# Altium schematic sheet sch_Gateway_RS232-Wifi_ESP8266.SchDoc
size A
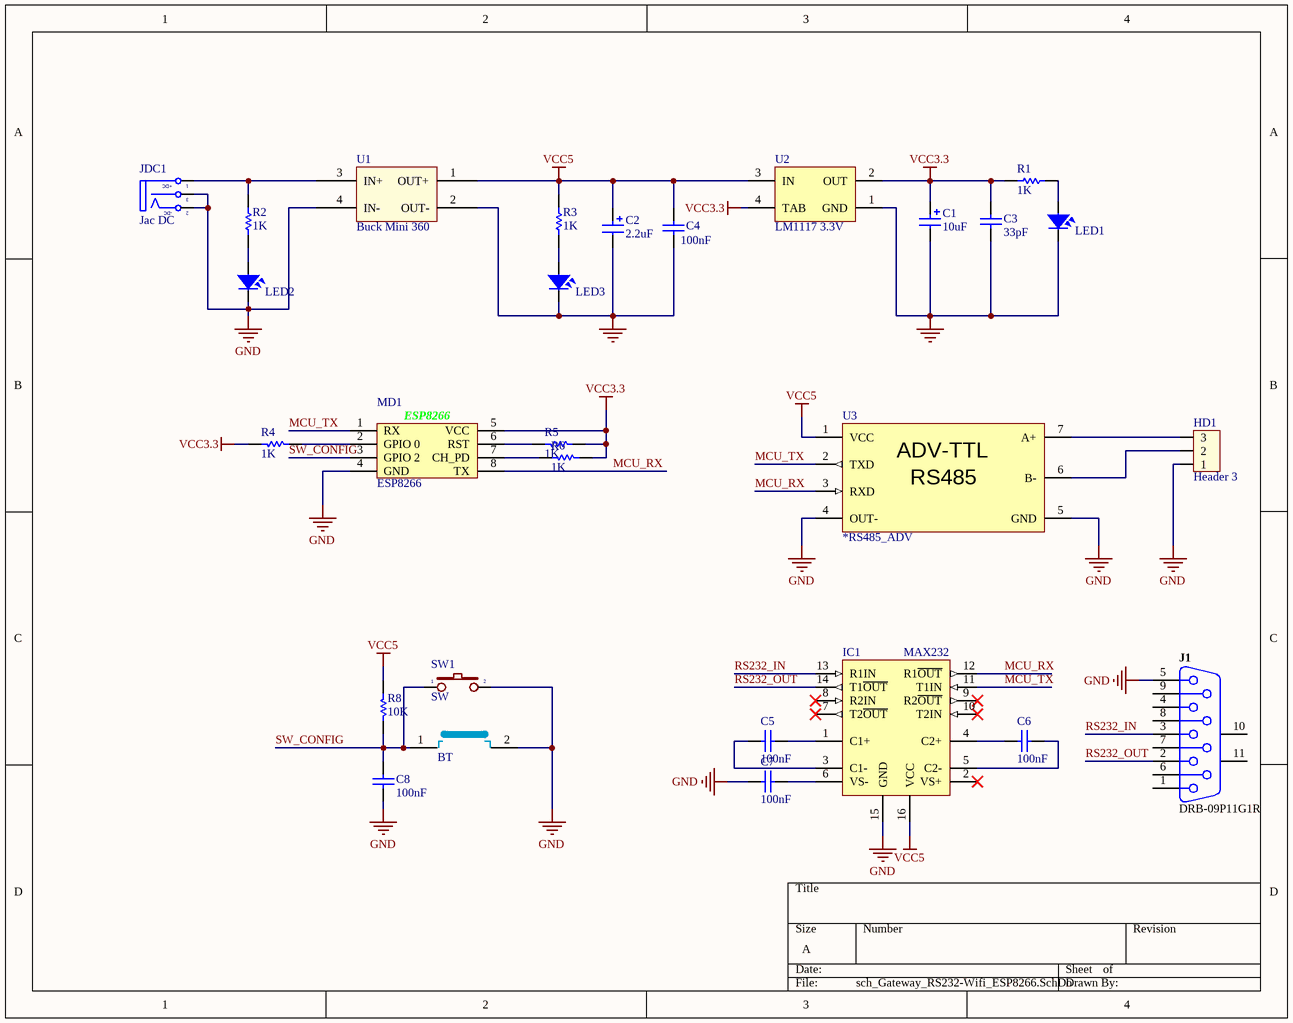
[diagram p0: sch_Gateway_RS232-Wifi_ESP8266.SchDoc]

## Parts
BT1  BT  [SW4]
C1  10uF  [C tantalum 3216-18]
C2  2.2uF  [C tantalum 3216-18]
C3  33pF  [C-0805]
C4  100nF  [C-0805]
C5  100nF  [C-0805]
C6  100nF  [C-0805]
C7  100nF  [C-0805]
C8  100nF  [C-0805]
HD1  Header 3  [HED3]
IC1  MAX232  [DIP16/W0.3]
J1  DRB-09P11G1R  [DB9_MALE]
JDC1  Jac DC  [DC0]
LED1  LED  [LED-0805-Red]  (value not drawn)
LED2  LED  [LED-0805-Red]  (value not drawn)
LED3  LED  [LED-0805-Red]  (value not drawn)
MD1  ESP8266  [ESP2866]
R1  1K  [R-0805]
R2  1K  [R-0805]
R3  1K  [R-0805]
R4  1K  [R-0805]
R5  1K  [R-0805]
R6  1K  [R-0805]
R8  10K  [R-0805]
SW1  SW  [SW1-DIP]
U1  Buck Mini 360  [Buck Mini 360]
U2  LM1117 3.3V  [IC PACKGE SOT223_N]
U3  *RS485_ADV  [RS485_ADV-TTL]

## Nets
GND: BT1.2 C1.2 C2.2 C3.2 C4.2 C7.2 C8.2 HD1.1 IC1.15(GND) J1.5 JDC1.2(TN) JDC1.3(S) LED1.2 LED2.2 LED3.2 MD1.4(GND) SW1.2 U1.2(OUT-) U1.4(IN-) U2.1(GND) U3.4(OUT-) U3.5(GND)
VCC3.3: C1.1 C3.1 MD1.5(VCC) R1.1 R4.1 R5.2 R6.2 U2.2(OUT) U2.4(TAB)
VCC5: C2.1 C4.1 IC1.16(VCC) R3.2 R8.2 U1.1(OUT+) U2.3(IN) U3.1(VCC)
MCU_RX: IC1.12(R1~{OUT}) MD1.8(TX) U3.3(RXD)
MCU_TX: IC1.11(T1IN) MD1.1(RX) U3.2(TXD)
RS232_IN: IC1.13(R1IN) J1.3
RS232_OUT: IC1.14(T1~{OUT}) J1.2
SW_CONFIG: BT1.1 C8.1 MD1.3(GPIO_2) R8.1 SW1.1
NetC5_1: C5.1 IC1.1(C1+)
NetC5_2: C5.2 IC1.3(C1-)
NetC6_1: C6.1 IC1.4(C2+)
NetC6_2: C6.2 IC1.5(C2-)
NetC7_1: C7.1 IC1.6(VS-)
NetHD1_2: HD1.2 U3.6(B-)
NetHD1_3: HD1.3 U3.7(A+)
NetJDC1_1: JDC1.1(T) R2.2 U1.3(IN+)
NetLED1_1: LED1.1 R1.2
NetLED2_1: LED2.1 R2.1
NetLED3_1: LED3.1 R3.1
NetMD1_2: MD1.2(GPIO_0) R4.2
NetMD1_6: MD1.6(RST) R5.1
NetMD1_7: MD1.7(CH_PD) R6.1

Not connected (* = marked no-connect by the designer): IC1 2(VS+)* 7(T2~{OUT})* 8(R2IN)* 9(R2~{OUT})* 10(T2IN)*; J1 1 4 6 7 8 9 10(MH1) 11(MH2)

## Notes on the sheet
- (in symbol DCIN) +DC; -DC
- (in symbol RS485_ADV-TTL) ADV-TTL; RS485

## Library data of the parts
BT1 = BUTTON
C1 C2 = C Tantalum SMD 3216: Midget Conformal Coated Solid Tantalum Chip Capacitor; Note: See Data Sheet for full range of components; Published: 19-Mar-2004; DatasheetDocument: 05-Jul-2002; PackageReference: A; Publisher: Altium Limited; ComponentLink1Description: Manufacturer Link; ComponentLink1URL: http://www.vishay.com/; ComponentLink2Description: Datasheet; ComponentLink2URL: http://www.vishay.com/docs/40000/194d.pdf
  C1: Value: 10uF
  C2: Value: 2.2uF
C3-C8 = Cap Ceramic: Capacitor (Semiconductor SIM Model); Value: 100pF; Published: 8-Jun-2000; LatestRevisionDate: 29-May-2009; LatestRevisionNote: IPC-7351 Footprint Added.; PackageReference: C1206; Publisher: Altium Limited; PackageDescription: Chip Capacitor
HD1 = Hed3: Header 3 (Green); Value: Header 3
IC1 = MAX232: Dual EIA-232 Driver/Receiver; Value: MAX232
J1 = CON 9 Male: Connector, DB9 R/A Through-hole Male; Connector type: Header; Max Current: 3A; Mounting Technology: Through-Hole; Pin Count: 9; Status: Unreleased; Category: Connector
JDC1 = DCIN: Jac DC input; Value: Jac DC
LED1-LED3 = LED SMD: Value: LED 3 - 5 ly 2 Colour
R1-R6 R8 = RES: Rectangular Thick Film Chip Resistor, 10 Ohm to 1M Ohm Range, 0.1% and 0.5% Tolerance, 1/8W; Note: If flow soldering, adjust pad width of PCB Footprint to 0.7 - 0.8 times the width of the resistor.; Published: 17-Dec-2003; LatestRevisionDate: 19-Mar-2004; LatestRevisionNote: Silkscreen size reduced.; PackageDocument: Mar-2003; PackageReference: ERA-0805; Publisher: Altium Limited; Code_IPC: 2012 [0805]; ComponentLink1Description: Manufacturer Link; ComponentLink1URL: http://www.panasonic.com/industrial/components/resistive_products.htm; ComponentLink2Description: Datasheet; ComponentLink2URL: http://www.panasonic.com/industrial/components/pdf/AOA0000CE8.pdf
  R2-R6: Value: 1K
  R8: Value: 10K
SW1 = SW2: Switch button 2 pin; Value: SW chip 2 pin
U2 = IC POWER LM1117MPX-3.3: 800mA Low-Dropout Linear Regulator, 4-pin SOT-223; Manufacturer: National Semiconductor; PackageTopMarking: XYTT*N05A; PowerWise: N; CompType: LDO IC; Published: 1-Mar-2010; DatasheetVersion: Apr-2006; PackageVersion: revB, Apr-2003; PackageReference: MP04A; Publisher: Altium Limited; PackageDescription: Molded SOT-223, 6.50 x 3.56 x 1.6mm Body, 4 Lead, 2.3mm Pitch; Supplier 1: Farnell; Supplier Part Number 1: 1652313; PartNumber: LM1117MPX-3.3; RoHS: N; PinCount: 4; Code_JEDEC: TO-261-AA; Code_IPC: SOT223-4; ComponentLink1Description: LM1117 Datasheet; ComponentLink1URL: http://www.national.com/ds/LM/LM1117.pdf; ComponentLink2Description: LM1117 Web Page; ComponentLink2URL: http://www.national.com/pf/LM/LM1117.html; ComponentLink3Description: MP04A Package Page; ComponentLink3URL: http://www.national.com/packaging/folders/mp04a.html
U3 = RS485_ADV-TTL: Module RS485